# EAGLE schematic v1.0 (EAGLE 9.1.3)
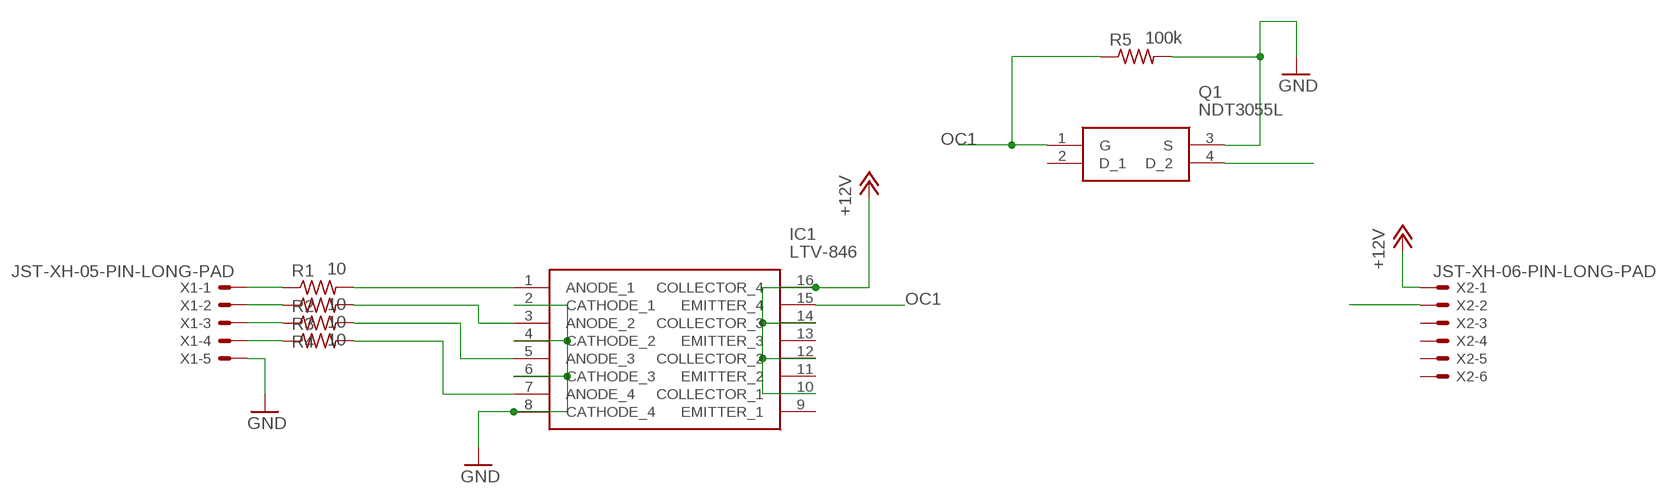
[diagram p0: schematic, sheet 1]

## Parts
IC1  LTV-846  [DIP762W60P254L1984H400Q16N]
Q1  NDT3055L  [SOT230P700X180-4N]
R1  10  R-US_R0805  [R0805]
R2  10  R-US_R0805  [R0805]
R3  10  R-US_R0805  [R0805]
R4  10  R-US_R0805  [R0805]
R5  100k  R-US_R0805  [R0805]
X1  JST-XH-05-PIN-LONG-PAD  [JST-XH-05-PACKAGE-LONG-PAD]
X2  JST-XH-06-PIN-LONG-PAD  [JST-XH-06-PACKAGE-LONG-PAD]

## Nets
+12V: IC1.10(COLLECTOR_1) IC1.12(COLLECTOR_2) IC1.14(COLLECTOR_3) IC1.16(COLLECTOR_4) X2.1
GND: Q1.3(S) R5.2
GND1: IC1.2(CATHODE_1) IC1.4(CATHODE_2) IC1.6(CATHODE_3) IC1.8(CATHODE_4) X1.5 ; supply symbol labelled GND
N$1: R1.1 X1.1
N$2: R2.1 X1.2
N$3: R3.1 X1.3
N$4: R4.1 X1.4
N$5: IC1.1(ANODE_1) R1.2
N$6: IC1.3(ANODE_2) R2.2
N$7: IC1.5(ANODE_3) R3.2
N$8: IC1.7(ANODE_4) R4.2
N$10: X2.2
N$12: Q1.4(D_2)
OC1: IC1.15(EMITTER_4) Q1.1(G) R5.1
Unconnected: IC1.9(EMITTER_1) IC1.11(EMITTER_2) IC1.13(EMITTER_3) Q1.2(D_1) X2.3 X2.4 X2.5 X2.6

## Library data of the parts
IC1 = SamacSys_Parts:LTV-846: Lite-On LTV-846 DC Input Transistor Output Quad Optocoupler, Through Hole, 16-Pin PDIP Source: Datasheet <http://uk.rs-online.com/web/p/products/6912221/?cm_mmc=UK-PPC-_-google-_-3_UK_EN_M_SEMIS_Broad-_-lite_on%7Coptocouplers&mkwid=sm11EfJLP_dc%7Cpcrid%7C79438450515%7Cpkw%7C%2Bltv+%2B846%7Cpmt%7Cb%7Cprd%7C&gclid=CJPszde1htUCFQcQ0wodzCI>; DESCRIPTION: Lite-On LTV-846 DC Input Transistor Output Quad Optocoupler, Through Hole, 16-Pin PDIP; HEIGHT: 4mm; MANUFACTURER_NAME: Lite-On; MANUFACTURER_PART_NUMBER: LTV-846; MOUSER_PART_NUMBER: 859-LTV-846; MOUSER_PRICE-STOCK: https://www.mouser.com/Search/Refine.aspx?Keyword=859-LTV-846; RS_PART_NUMBER: 1689677; RS_PRICE-STOCK: http://uk.rs-online.com/web/p/products/1689677
Q1 = SamacSys_Parts:NDT3055L: MOSFET N-Channel 60V 4A SOT223 Fairchild NDT3055L N-channel MOSFET Transistor, 4 A, 60 V, 3+Tab-Pin SOT-223 Source: Datasheet <https://www.fairchildsemi.com/datasheets/ND/NDT3055L.pdf>; DESCRIPTION: MOSFET N-Channel 60V 4A SOT223 Fairchild NDT3055L N-channel MOSFET Transistor, 4 A, 60 V, 3+Tab-Pin SOT-223; HEIGHT: 1.8mm; MANUFACTURER_NAME: Fairchild Semiconductor; MANUFACTURER_PART_NUMBER: NDT3055L; MOUSER_PART_NUMBER: 512-NDT3055L; MOUSER_PRICE-STOCK: https://www.mouser.com/Search/Refine.aspx?Keyword=512-NDT3055L; RS_PART_NUMBER: 6711090; RS_PRICE-STOCK: http://uk.rs-online.com/web/p/products/6711090
R1-R5 = resistor:R-US_: RESISTOR, American symbol
X1 = Rembrandt:JST-XH-05-PIN: JST XH Connector 2 Pin Wire to board connector. Pitch: 2,54 mm, (0.100") Number of pins: 5 Created by Rembrandt Electronics www.rembrandtelectronics.com
X2 = Rembrandt:JST-XH-06-PIN: JST XH Connector 2 Pin Wire to board connector. Pitch: 2,54 mm, (0.100") Number of pins: 6 Created by Rembrandt Electronics www.rembrandtelectronics.com